# Altium schematic sheet STM8S003F3P6.SchDoc
size A4
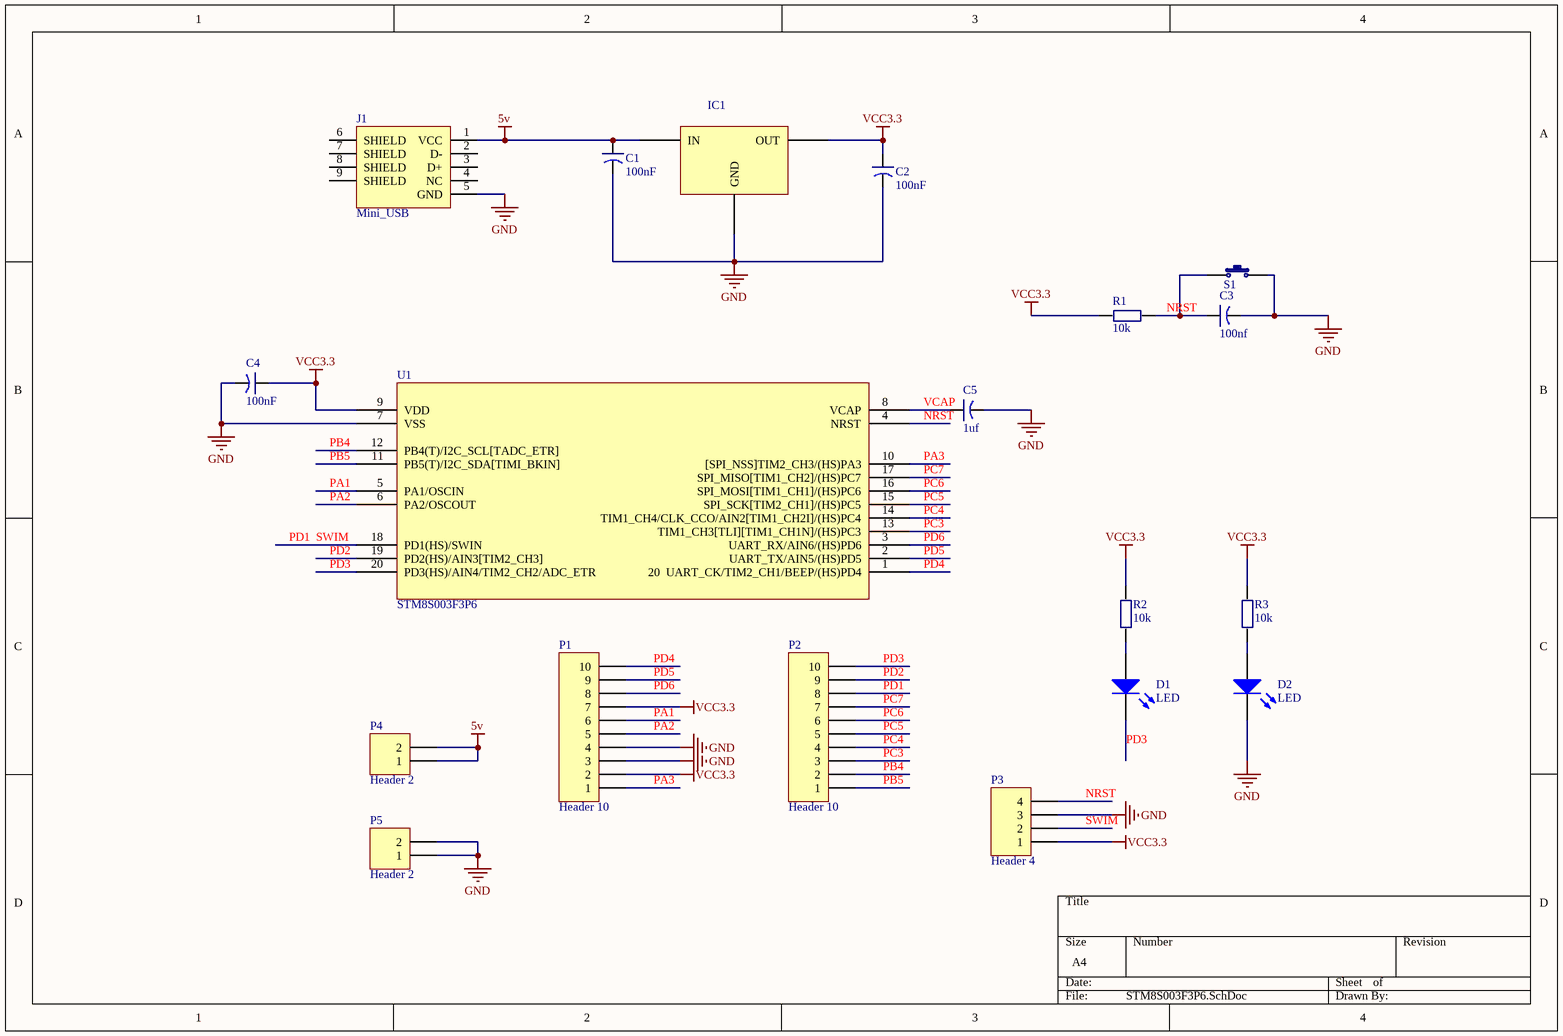
[diagram p0: STM8S003F3P6.SchDoc]

## Parts
C1  value 100nF  [C0805]  (hidden comment: Capacitor)
C2  value 100nF  [C0805]  (hidden comment: Capacitor)
C3  value 100nf  [C0805]  (hidden comment: Capacitor)
C4  value 100nF  [C0805]  (hidden comment: Capacitor)
C5  value 1uf  [C0805]  (hidden comment: Capacitor)
D1  LED  [0805D]
D2  LED  [0805D]
IC1  ASM1117  [SOT-223]  (value not drawn)
J1  Mini_USB  [Mini_USB]
P1  Header 10  [HDR1X10]
P2  Header 10  [HDR1X10]
P3  Header 4  [HDR1X4]
P4  Header 2  [HDR1X2]
P5  Header 2  [HDR1X2]
R1  value 10k  [R0805]  (hidden comment: Resistor)
R2  value 10k  [R0805]  (hidden comment: Resistor)
R3  value 10k  [R0805]  (hidden comment: Resistor)
S1  Switch  [TD-19XA]  (value not drawn)
U1  STM8S003F3P6  [STM8S003F3P6]

## Nets
5v: C1.1 IC1.3(IN) J1.1(VCC) P4.1 P4.2
GND: C1.2 C2.2 C3.2 C4.2 C5.2 D2.2(K) IC1.1(GND) J1.5(GND) P1.3 P1.4 P3.3 P5.1 P5.2 S1.2 U1.7(VSS)
VCC3.3: C2.1 C4.1 IC1.2(OUT) P1.2 P1.7 P3.1 R1.2 R2.2 R3.2 U1.9(VDD)
NRST: C3.1 P3.4 R1.1 S1.1 U1.4(NRST)
PA1: P1.6 U1.5(PA1/OSCIN)
PA2: P1.5 U1.6(PA2/OSCOUT)
PA3: P1.1 U1.10([SPI_NSS]TIM2_CH3/(HS)PA3)
PB4: P2.2 U1.12(PB4(T)/I2C_SCL[TADC_ETR])
PB5: P2.1 U1.11(PB5(T)/I2C_SDA[TIMI_BKIN])
PC3: P2.3 U1.13(TIM1_CH3[TLI][TIM1_CH1N]/(HS)PC3)
PC4: P2.4 U1.14(TIM1_CH4/CLK_CCO/AIN2[TIM1_CH2I]/(HS)PC4)
PC5: P2.5 U1.15(SPI_SCK[TIM2_CH1]/(HS)PC5)
PC6: P2.6 U1.16(SPI_MOSI[TIM1_CH1]/(HS)PC6)
PC7: P2.7 U1.17(SPI_MISO[TIM1_CH2]/(HS)PC7)
PD1: P2.8 P3.2 U1.18(PD1(HS)/SWIN)  [also labelled SWIM]
PD2: P2.9 U1.19(PD2(HS)/AIN3[TIM2_CH3])
PD3: D1.2(K) P2.10 U1.20(PD3(HS)/AIN4/TIM2_CH2/ADC_ETR)
PD4: P1.10 U1.1(20__UART_CK/TIM2_CH1/BEEP/(HS)PD4)
PD5: P1.9 U1.2(UART_TX/AIN5/(HS)PD5)
PD6: P1.8 U1.3(UART_RX/AIN6/(HS)PD6)
VCAP: C5.1 U1.8(VCAP)
NetD1_1: D1.1(A) R2.1
NetD2_1: D2.1(A) R3.1

Not connected (* = marked no-connect by the designer): J1 2(D-) 3(D+) 4(NC) 6(SHIELD) 7(SHIELD) 8(SHIELD) 9(SHIELD)

## Library data of the parts
P1 P2 = Header 10: Header, 10-Pin; LatestRevisionDate: 17-Jul-2002; LatestRevisionNote: Re-released for DXP Platform.; Publisher: Altium Limited
P3 = Header 4: Header, 4-Pin; LatestRevisionDate: 17-Jul-2002; LatestRevisionNote: Re-released for DXP Platform.; Publisher: Altium Limited
P4 P5 = Header 2: Header, 2-Pin; LatestRevisionDate: 17-Jul-2002; LatestRevisionNote: Re-released for DXP Platform.; Publisher: Altium Limited
S1 = Switch: value: *